# EAGLE design Driver (EAGLE 9.5.1)
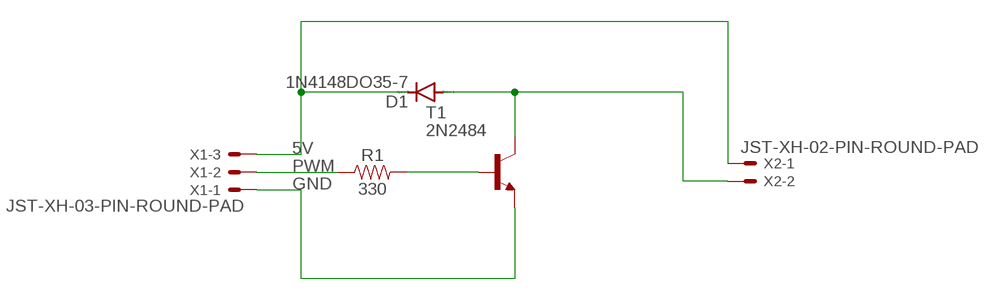
[diagram p0: schematic, sheet 1]

## Parts
D1  1N4148DO35-7  [DO35-7]
R1  330  330OHM-HORIZ-1/10W-5%  [AXIAL-0.3]
T1  2N2484  [TO18]
X1  JST-XH-03-PIN-ROUND-PAD  [JST-XH-03-PACKAGE-ROUND-PAD]
X2  JST-XH-02-PIN-ROUND-PAD  [JST-XH-02-PACKAGE-ROUND-PAD]

## Nets
5V: D1.C X1.3 X2.1
GND: T1.1(E) X1.1
N$1: R1.P$2 T1.2(B)
N$3: D1.A T1.3(C) X2.2
PWM: R1.P$1 X1.2

## Library data of the parts
D1 = diode:1N4148: DIODE high speed (Philips)
R1 = SparkFun-Resistors:330OHM: 330Ω resistor A resistor is a passive two-terminal electrical component that implements electrical resistance as a circuit element. Resistors act to reduce current flow, and, at the same time, act to lower voltage levels within circuits. - Wikipedia; PROD_ID: RES-8371
T1 = transistor-neu-to92:2N2484: NPN TRANSISTOR
X1 = Rembrandt Electronics - JST XH Connectors v1-0:JST-XH-03-PIN: JST XH Connector 2 Pin Wire to board connector. Pitch: 2,54 mm, (0.100") Number of pins: 3 Created by Rembrandt Electronics www.rembrandtelectronics.com
X2 = Rembrandt Electronics - JST XH Connectors v1-0:JST-XH-02-PIN: JST XH Connector 2 Pin Wire to board connector. Pitch: 2,54 mm, (0.100") Number of pins: 2 Created by Rembrandt Electronics www.rembrandtelectronics.com

## Board
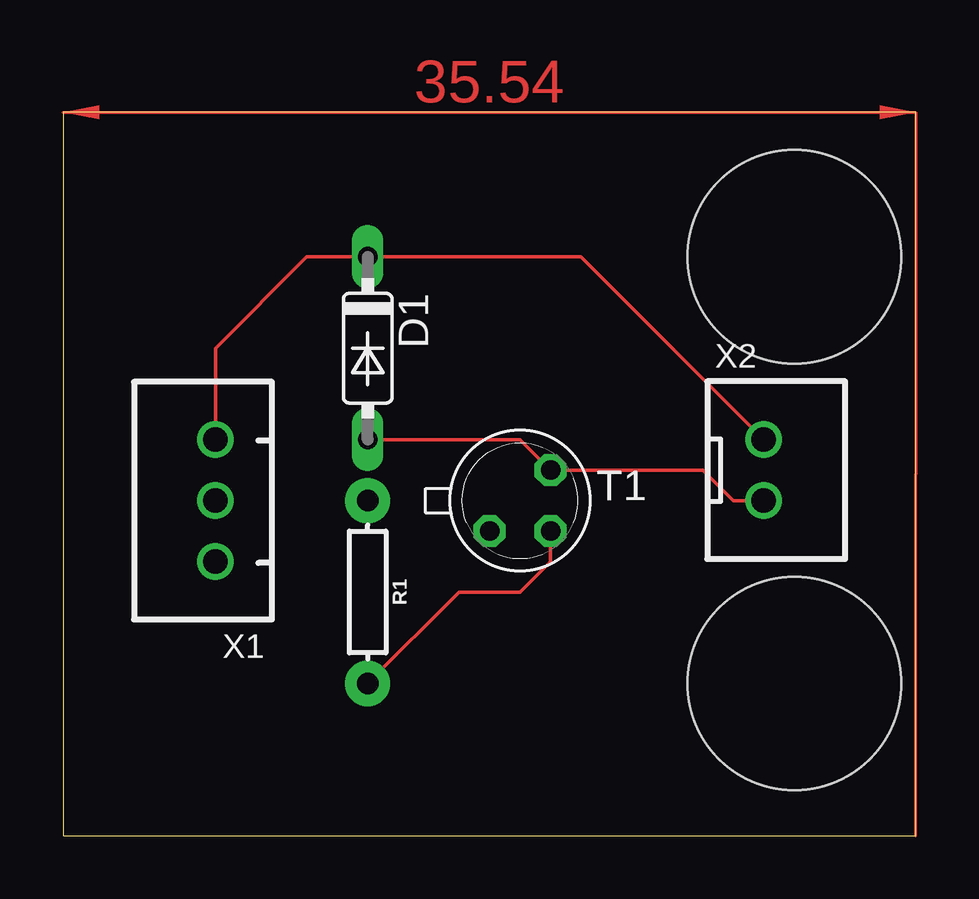
[diagram p1: board, top side]
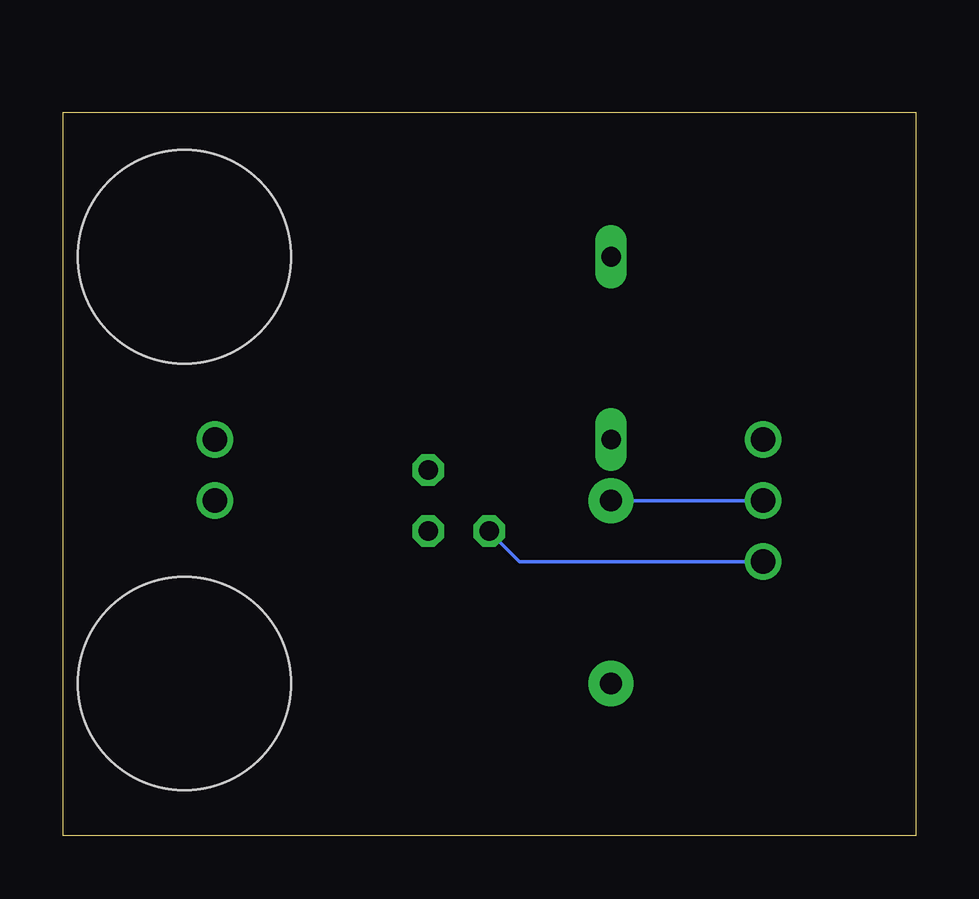
[diagram p2: board, bottom side, seen from below]

Size 35.54 x 30.15 mm. Coordinates in mm from the lower left corner, seen from the top.
Outline: 0,0 35.54,0 35.54,30.15 0,30.15 0,0
Copper layers (1*16): Top 0.035mm / dielectric 1.5mm / Bottom 0.035mm
Design rules "default": minimum track width 6mil, minimum drill 0.35mm, track to track 6mil, track to pad 6mil, pad to pad 6mil, via to via 6mil, smd to smd 6mil, copper to edge 40mil, drill to drill 6mil, minimum pad ring 10mil, minimum via ring 8mil, stop-mask expansion 4mil, vias tented up to drill 0mil, thermal gap 10mil
Holes 8.89 mm at 30.48,24.13 30.48,6.35

### Footprints (pad centres in the part's own frame; a part is rotated, then mirrored left to right if it is on the bottom)
DO35-7 = drill 0.813 long: A 3.81,0; C -3.81,0
AXIAL-0.3 = drill 0.9 pad 1.88: P$1 -3.81,0; P$2 3.81,0
TO18 = drill 0.813 octagon: 1 -1.27,-1.27; 2 1.27,-1.27; 3 1.27,1.27
JST-XH-03-PACKAGE-ROUND-PAD = drill 1.016: 1 -2.54,0; 2 0,0; 3 2.54,0
JST-XH-02-PACKAGE-ROUND-PAD = drill 1.016: 1 -1.27,0; 2 1.27,0

### Placement (x,y rotation side)
D1  12.7,20.32 270 top
R1  12.7,10.16 270 top
T1  19.05,13.97 0 top
X1  6.35,13.97 90 top
X2  29.21,15.24 270 top

### Tracks (layer width: path | path; a pad name or v marks a point on that pad's centre or on a via)
5V
  Top 0.152: X1.3 6.35,20.32 10.16,24.13 D1.C 21.59,24.13 X2.1
GND
  Bottom 0.152: X1.1 16.51,11.43 T1.1
N$1
  Top 0.152: R1.P$2 16.51,10.16 19.05,10.16 20.32,11.43 T1.2
N$3
  Top 0.152: D1.A 19.05,16.51 T1.3 26.67,15.24 27.94,13.97 X2.2
PWM
  Bottom 0.152: X1.2 R1.P$1
(copper drawn outside any net)
  shapes: Top area x2